# Altium schematic sheet contactor_feedback.SchDoc: foxBMS BMS-Extension
size A3; DocumentNumber: 5; SheetNumber: 5; SheetTotal: 14; Author: Fraunhofer IISB foxBMS Team; REL-DATE: 2017-05-16; VERSION: 1.0.2; GateName_1: G$1; SymbolName_1: FRAME_B_L; LibraryName: foxBMS_BMS-Master_V1.00_A; DeviceSetName: FRAME_B_L; GateName_2: G$2; SymbolName_2: DOCFIELD; SheetDescription: Contactor Feedback
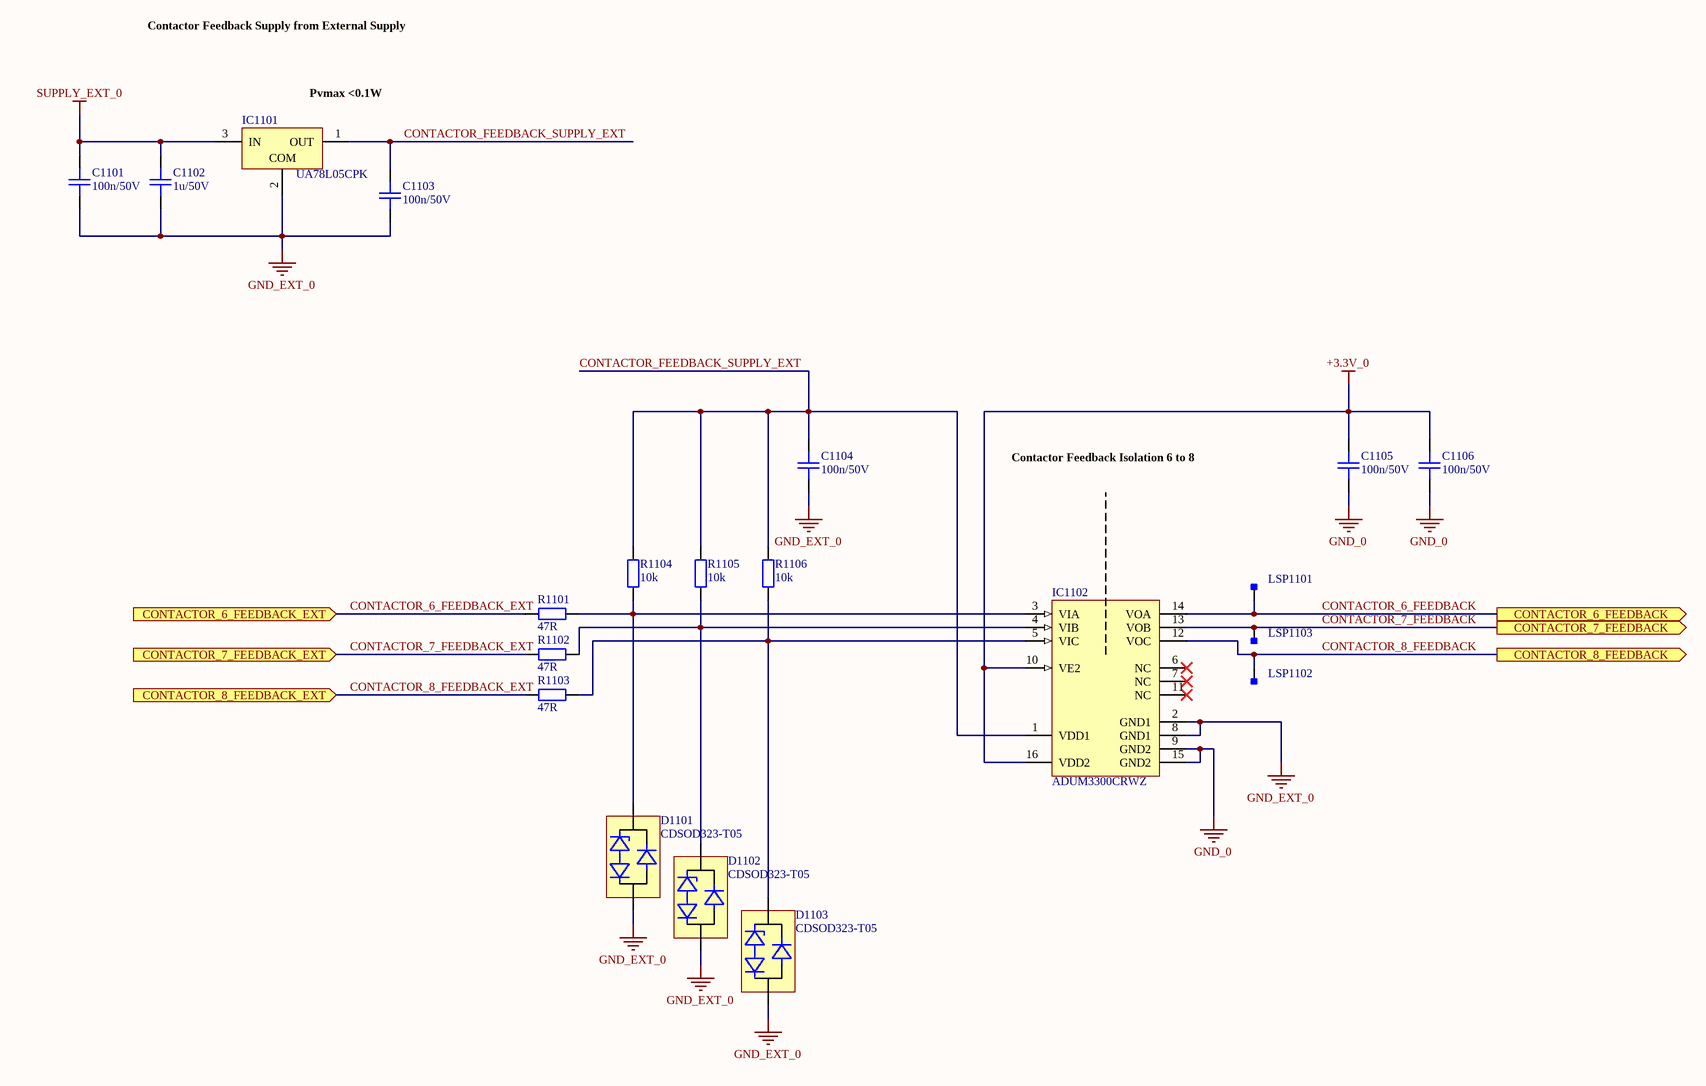
[diagram p0: contactor_feedback.SchDoc]

## Parts
C1101  100n/50V  [CAPC1608X08N]
C1102  1u/50V  [CAPC1608X08N]
C1103  100n/50V  [CAPC1608X08N]
C1104  100n/50V  [CAPC1608X08N]
C1105  100n/50V  [CAPC1608X08N]
C1106  100n/50V  [CAPC1608X08N]
D1101  CDSOD323-T05  [SODFL250X110-2N]
D1102  CDSOD323-T05  [SODFL250X110-2N]
D1103  CDSOD323-T05  [SODFL250X110-2N]
IC1101  UA78L05CPK  [PK0003A_L]
IC1102  ADUM3300CRWZ  [ADI-RW-16_L]
LSP1101  Testpoint_Square  [Testpoint_S1]  (value not drawn)  (no BOM)
LSP1102  Testpoint_Square  [Testpoint_S1]  (value not drawn)  (no BOM)
LSP1103  Testpoint_Square  [Testpoint_S1]  (value not drawn)  (no BOM)
R1101  47R  [RESC1608X05N]
R1102  47R  [RESC1608X05N]
R1103  47R  [RESC1608X05N]
R1104  10k  [RESC1608X05N]
R1105  10k  [RESC1608X05N]
R1106  10k  [RESC1608X05N]

## Ports
CONTACTOR_6_FEEDBACK (out), CONTACTOR_6_FEEDBACK_EXT (in), CONTACTOR_7_FEEDBACK (out), CONTACTOR_7_FEEDBACK_EXT (in), CONTACTOR_8_FEEDBACK (out), CONTACTOR_8_FEEDBACK_EXT (in)

## Nets
+3.3V_0: C1105.1 C1106.1 IC1102.10(VE2) IC1102.16(VDD2)
GND_0: C1105.2 C1106.2 IC1102.9(GND2) IC1102.15(GND2)
GND_EXT_0: C1101.2 C1102.2 C1103.2 C1104.2 D1101.2(A) D1102.2(A) D1103.2(A) IC1101.2(COM) IC1102.2(GND1) IC1102.8(GND1)
SUPPLY_EXT_0: C1101.1 C1102.1 IC1101.3(IN)
CONTACTOR_6_FEEDBACK: IC1102.14(VOA) LSP1101.1 ; port CONTACTOR_6_FEEDBACK
CONTACTOR_6_FEEDBACK_EXT: R1101.2 ; port CONTACTOR_6_FEEDBACK_EXT
CONTACTOR_7_FEEDBACK: IC1102.13(VOB) LSP1103.1 ; port CONTACTOR_7_FEEDBACK
CONTACTOR_7_FEEDBACK_EXT: R1102.2 ; port CONTACTOR_7_FEEDBACK_EXT
CONTACTOR_8_FEEDBACK: IC1102.12(VOC) LSP1102.1 ; port CONTACTOR_8_FEEDBACK
CONTACTOR_8_FEEDBACK_EXT: R1103.2 ; port CONTACTOR_8_FEEDBACK_EXT
CONTACTOR_FEEDBACK_SUPPLY_EXT: C1103.1 C1104.1 IC1101.1(OUT) IC1102.1(VDD1) R1104.2 R1105.2 R1106.2
NetD1101_1: D1101.1(K) IC1102.3(VIA) R1101.1 R1104.1
NetD1102_1: D1102.1(K) IC1102.4(VIB) R1102.1 R1105.1
NetD1103_1: D1103.1(K) IC1102.5(VIC) R1103.1 R1106.1

Not connected (* = marked no-connect by the designer): IC1102 6(NC)* 7(NC)* 11(NC)*

## Notes on the sheet
- Contactor Feedback Supply from External Supply
- (near IC1101) Pvmax <0.1W
- Contactor Feedback Isolation 6 to 8
- Fraunhofer IISB
- Schottkystr. 10
- developed by:
- 91058 Erlangen
- Germany
- Author
- Project
- License
- Description
- File
- Version
- Release Date
- Sheet
- www.foxbms.org
- www.iisb.fraunhofer.de
- foxBMS Team
- /

## Library data of the parts
C1101 C1103-C1106 = gen_C_ceramic_100n_50V_X7R_0603: MLCC; Capacitance: 100n; Rated Voltage: 50V; Dielectric: X7R; Case EIA: 0603; Case Metric: 1608; PnP Package: C_0603_10; PnP Value: 100n/50V/X7R; PnP equipped: x; Part Number: gen_C_ceramic_100n_50V_X7R_0603; Supplier 1: Farnell; Supplier Part Number 1: 2525267
C1102 = gen_C_ceramic_1u_50V_X7R_0603: MLCC; Capacitance: 1u; Rated Voltage: 50V; Dielectric: X7R; Tolerance: ± 10%; Case EIA: 0603; Case Metric: 1608; Part Number: gen_C_ceramic_1u_50V_X7R_0603; Operating Temperature: -55°C - +125°C; Supplier 1: Farnell; Supplier Part Number 1: 2779055
D1101-D1103 = CDSOD323-T05: TVS Diode, CDSOD323 Series, Unidirectional, 5 V, 18.3 V, SOD-323, 2 Pins; Manufacturer: Bourns; Breakdown Voltage: 6V; Part Number: CDSOD323-T05; Part Name: CDSOD323-T05; Operating Temperature: -55°C - +150°C; ComponentLink1Description: Datasheet; ComponentLink1URL: http://www.farnell.com/datasheets/1845299.pdf; Supplier 1: Farnell; Supplier Part Number 1: 2341914
IC1101 = CMP-2000-07341-1: Positive-Voltage Regulator, 100 mA, 0 to 125 degC, 3-Pin SOT-89 (PK), Green (RoHS & no Sb/Br), Tape and Reel; Manufacturer: TexasInstruments; Load Regulation: 60mV; Input Voltage MIN: 7V; Number of Outputs: 1; Input Voltage MAX: 20V; Output Type: Fixed; Output Current: 100mA; Output Voltage: 5V; PSRR / Ripple Rejection - Typ: 49dB; Line Regulation: 200mV; Mounting Style: SMD/SMT; Datasheet Version: Rev. U, 05/2011; Polarity: Positive; Minimum Operating Temperature: 0C; Package Reference: PK0003A; Brand: TexasInstruments; Packaging: Reel; Product Category: LinearVoltageRegulators; RoHS: True; Datasheet URL: http://www.ti.com/lit/ds/symlink/ua78l05.pdf; Package URL: http://www.ti.com/lit/ml/mhsi001b/mhsi001b.pdf; Series: UA78L05; Manufacturer URL: http://www.ti.com/; Package Description: 3-Pin Small Outline Transistor, Body 4.5 x 2.5 mm, Pitch 1.5 mm; Mounting Technology: SurfaceMount; Package / Case: SOT-89-4; Maximum Operating Temperature: +125C
IC1102 = CMP-0534-00476-1: Triple Channel Digital Isolator, Enhanced System-Level ESD Reliability, 2.5 KV rms Insulation Rating, 90 Mbps Data Rate, 32 ns Delay, Industrial, 16-pin SOIC (RW-16), Tube; Manufacturer: Analog Devices; Max Data Rate: 90Mbps; Insulation Rating (kVrms): 2.5; Max Operating Temp (degreesC): 105; ComponentLink3Description: Package Specification; ComponentLink4URL: Product URL:http://www.analog.com/en/interface-isolation/digital-isolators/adum3300/products/product.html; Code_JEDEC: MS-013-AA; PackageDescription: 16-Pin Standard Small Outline Package, Body 10.3 x 7.5 mm, Pitch 1.27 mm; ComponentLink4Description: URL Link1; ComponentLink1URL: http://www.analog.com/en/index.html; ComponentLink2URL: http://www.analog.com/static/imported-files/data_sheets/ADUM3300_3301.pdf; ComponentLink2Description: Datasheet; ComponentLink1Description: Manufacturer URL; PackageVersion: 032707-B, 03/2007; PackageReference: RW-16; PartNumber: ADUM3300CRWZ; Mounting Technology: Surface Mount; ComponentLink3URL: http://www.analog.com/static/imported-files/packages/PKG_PDF/SOIC_WIDE%20%28RW%29/RW_16.pdf; DatasheetVersion: Rev. B
LSP1101-LSP1103 = Testpoint_Square: Testpoint, square; Part Number: Testpoint_Square
R1101-R1103 = gen_R_47R_0603: SMD Resistor 47R 0603; Tolerance: 1%; Power: 0.1W; Case EIA: 0603; Case Metric: 1608; Maximum Working Voltage: 75V; PnP Package: R_0603; Part Number: gen_R_47R_0603; Operating Temperature: -55°C - +155°C; Resistance: 47R; Series: E24; PnP Value: 47R; Supplier 1: Farnell; Supplier Part Number 1: 2303030
R1104-R1106 = gen_R_10k_0603: SMD Resistor 10k 0603; Tolerance: 1%; Power: 0.1W; Case EIA: 0603; Case Metric: 1608; Maximum Working Voltage: 75V; PnP Package: R_0603; Part Number: gen_R_10k_0603; Operating Temperature: -55°C - +155°C; Resistance: 10k; Series: E24, E96; PnP Value: 10k; Supplier 1: Farnell; Supplier Part Number 1: 2073349